# Altium schematic sheet PMT_simulator.SchDoc: =TopTitle
size 420 x 297 mm; EDA_Number: ARTIQ; Project: ALICE PMT; CheckedBy: -; Author: G.Kasprowicz; CompanyName: WUT ISE; DrawnBy: G.Kasprowicz; Organization: WUT ISE; Address1: PW ISE; Address2: Nowowiejska 15/19 00-665 Warsaw; Address3: gkasprow@gmail.com; SheetNumber: -; SheetTotal: -; ModifiedBy: -; CheckedDate: -; Title2: TOP; DivGrp: WUT ISE; Designer: G.Kasprowicz; ModifiedDate: -; ProjectName: Sensor Box
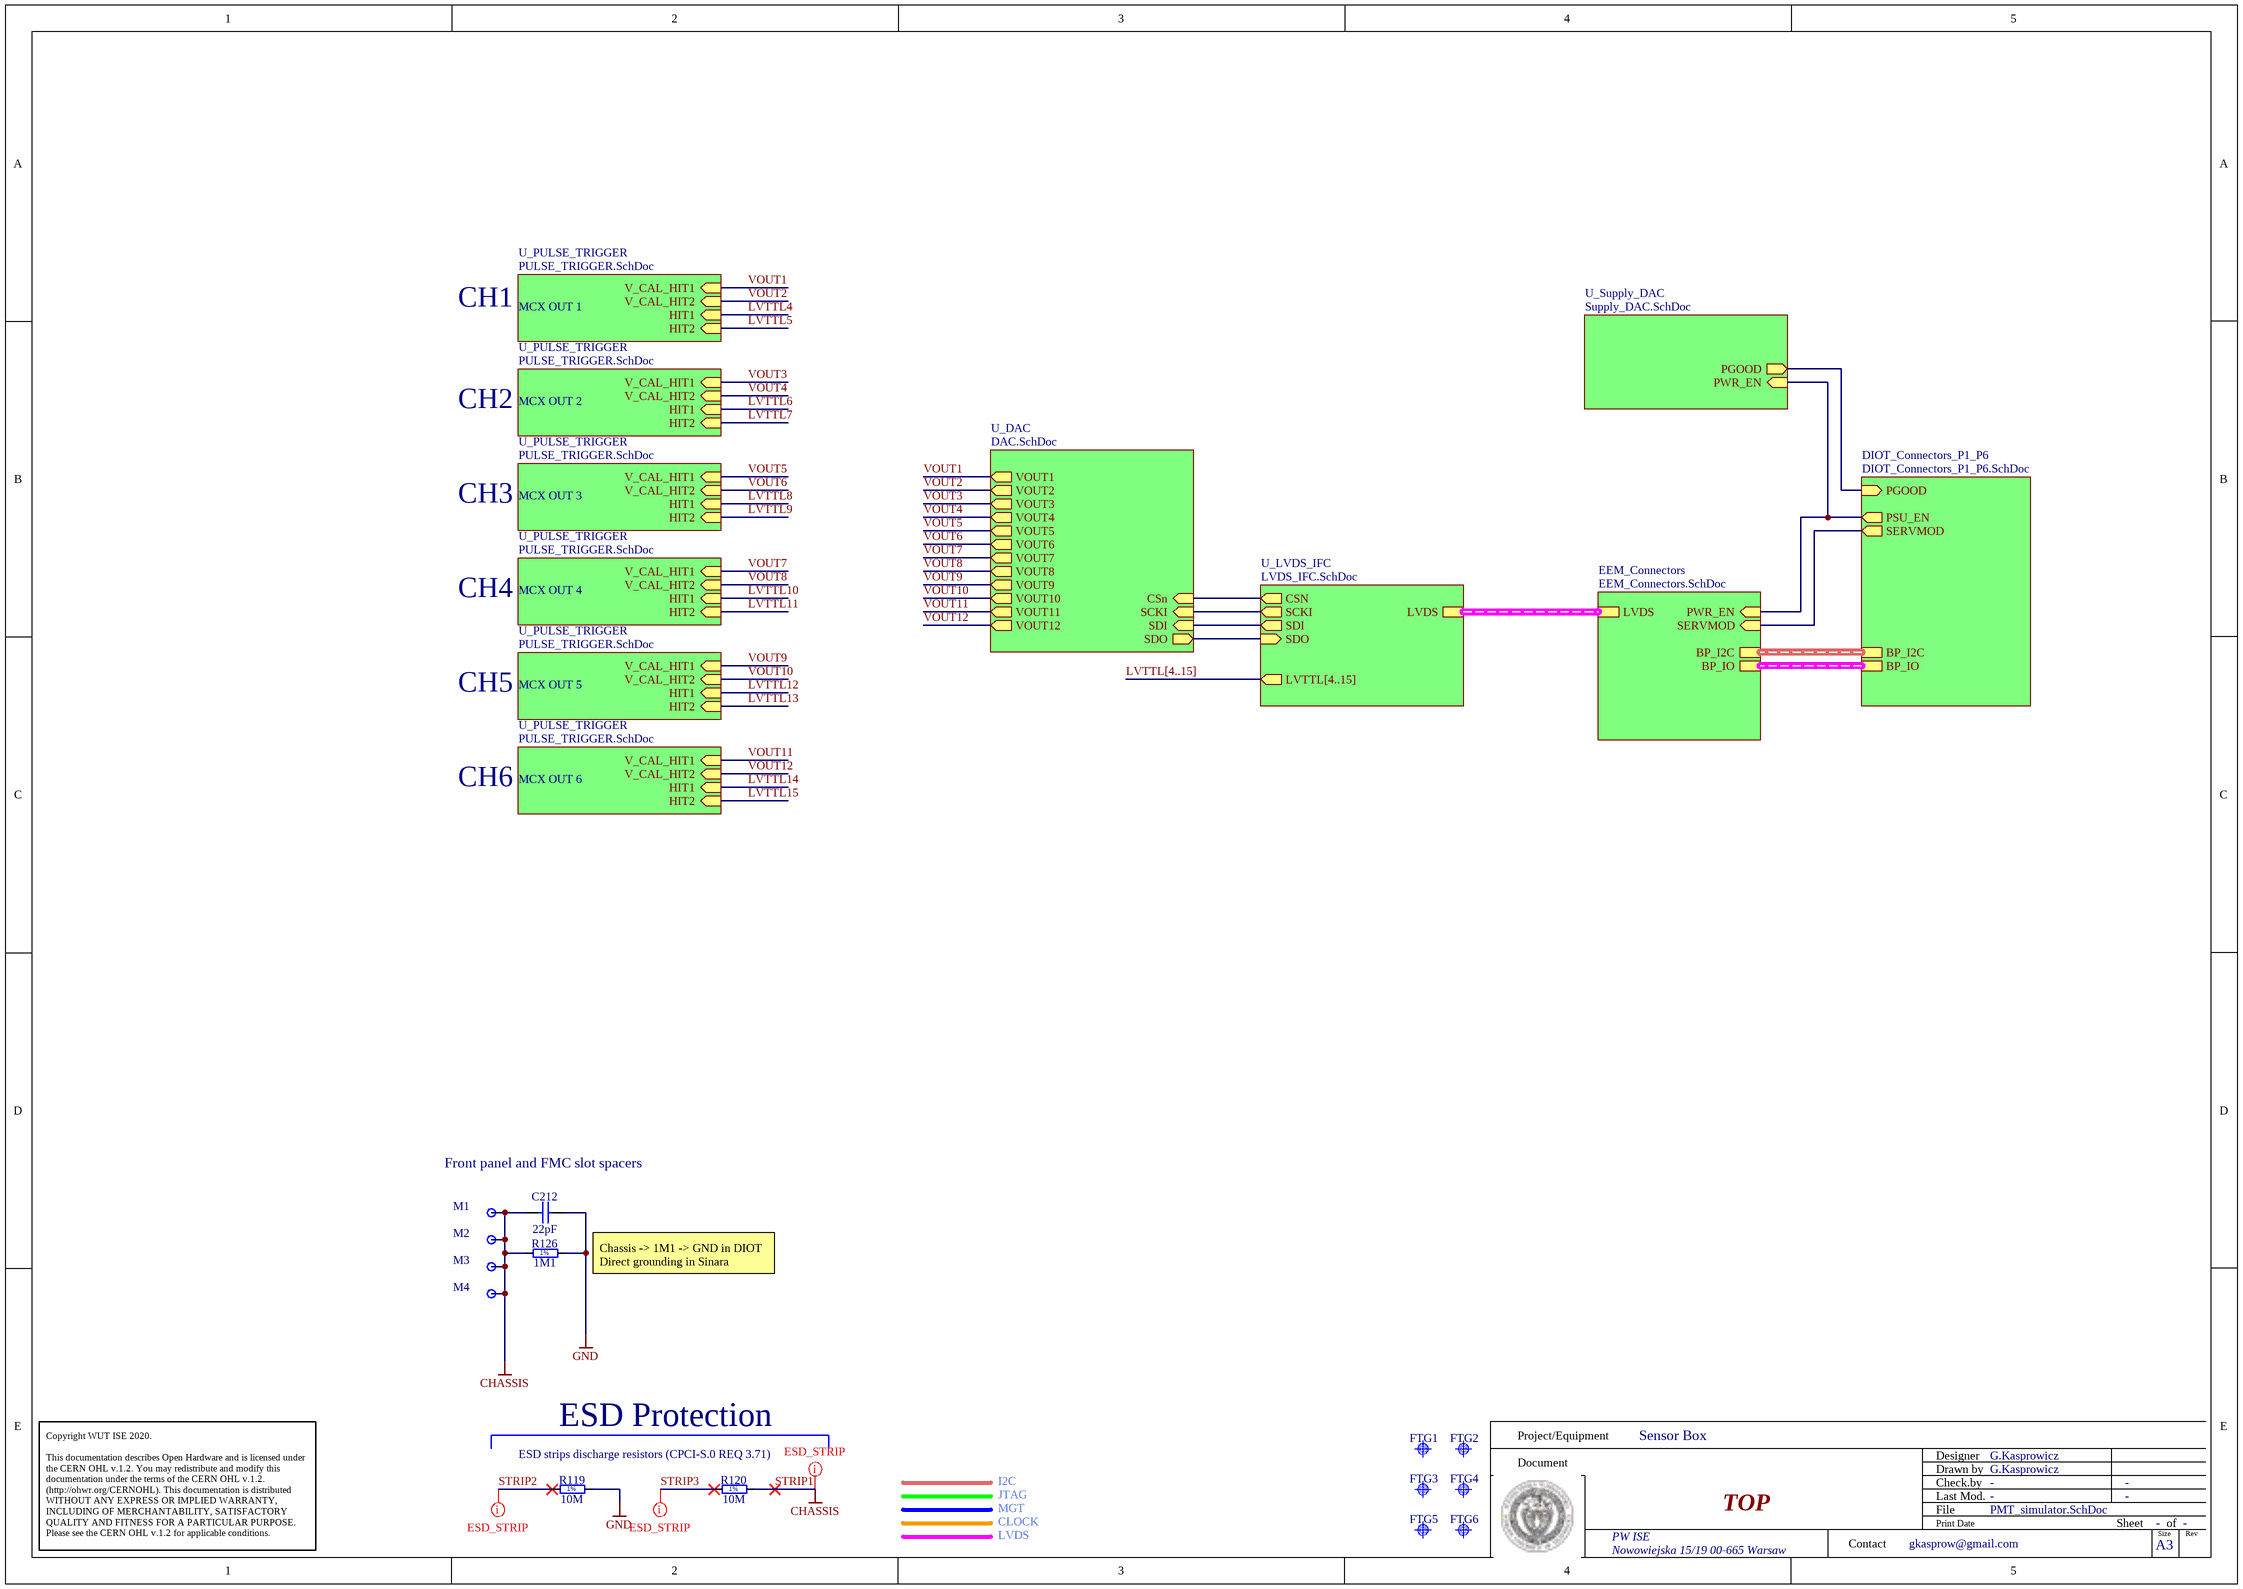
[diagram p0: PMT_simulator.SchDoc]

## Parts
C212  22pF  [CAPC1005X55N]
FTG1  Use only in PCB  [FIDUCIAL_TOP_S100-200]  (value not drawn)
FTG2  Use only in PCB  [FIDUCIAL_TOP_S100-200]  (value not drawn)
FTG3  Use only in PCB  [FIDUCIAL_TOP_S100-200]  (value not drawn)
FTG4  Use only in PCB  [FIDUCIAL_TOP_S100-200]  (value not drawn)
FTG5  Use only in PCB  [FIDUCIAL_TOP_S100-200]  (value not drawn)
FTG6  Use only in PCB  [FIDUCIAL_TOP_S100-200]  (value not drawn)
M1  Plated Hole  [MTG300_600]  (value not drawn)  (no BOM)
M2  Plated Hole  [MTG300_600]  (value not drawn)  (no BOM)
M3  Plated Hole  [MTG300_600]  (value not drawn)  (no BOM)
M4  Plated Hole  [MTG300_600]  (value not drawn)  (no BOM)
R119  10M  [RESC2113X55N]
R120  10M  [RESC2113X55N]
R126  1M1  [RESC2012X60N]

## Sub-sheets
DIOT_Connectors_P1_P6 = DIOT_Connectors_P1_P6.SchDoc: BP_I2C (harness I2C), BP_IO (harness EEM_LVDS), PSU_EN (out), SERVMOD (out), PGOOD (in)
EEM_Connectors = EEM_Connectors.SchDoc: LVDS (harness LVDS), BP_IO (harness EEM_LVDS), BP_I2C (harness I2C), SERVMOD (in), PWR_EN (in)
U_DAC = DAC.SchDoc: CSn (in), SDI (in), SCKI (in), SDO (out), VOUT1 (out), VOUT2 (out), VOUT3 (out), VOUT4 (out), VOUT5 (out), VOUT6 (out), VOUT7 (out), VOUT8 (out), VOUT9 (out), VOUT10 (out), VOUT11 (out), VOUT12 (out)
U_LVDS_IFC = LVDS_IFC.SchDoc: CSN (out), SDO (in), SCKI (out), SDI (out), LVDS (harness LVDS), LVTTL[4..15] (out)
U_PULSE_TRIGGER = PULSE_TRIGGER.SchDoc: V_CAL_HIT1 (in), V_CAL_HIT2 (in), HIT1 (in), HIT2 (in)
U_PULSE_TRIGGER = PULSE_TRIGGER.SchDoc: V_CAL_HIT1 (in), V_CAL_HIT2 (in), HIT1 (in), HIT2 (in)
U_PULSE_TRIGGER = PULSE_TRIGGER.SchDoc: V_CAL_HIT1 (in), V_CAL_HIT2 (in), HIT1 (in), HIT2 (in)
U_PULSE_TRIGGER = PULSE_TRIGGER.SchDoc: V_CAL_HIT1 (in), V_CAL_HIT2 (in), HIT1 (in), HIT2 (in)
U_PULSE_TRIGGER = PULSE_TRIGGER.SchDoc: V_CAL_HIT1 (in), V_CAL_HIT2 (in), HIT1 (in), HIT2 (in)
U_PULSE_TRIGGER = PULSE_TRIGGER.SchDoc: V_CAL_HIT1 (in), V_CAL_HIT2 (in), HIT1 (in), HIT2 (in)
U_Supply_DAC = Supply_DAC.SchDoc: PWR_EN (in), PGOOD (out)

## Nets
GND: C212.2 R119.2 R126.2
STRIP1: C212.1 M1.1 M2.1 M3.1 M4.1 R120.2 R126.1  [also labelled CHASSIS]
LVTTL4: sheet U_PULSE_TRIGGER/HIT1
LVTTL5: sheet U_PULSE_TRIGGER/HIT2
LVTTL6: sheet U_PULSE_TRIGGER/HIT1
LVTTL7: sheet U_PULSE_TRIGGER/HIT2
LVTTL8: sheet U_PULSE_TRIGGER/HIT1
LVTTL9: sheet U_PULSE_TRIGGER/HIT2
LVTTL10: sheet U_PULSE_TRIGGER/HIT1
LVTTL11: sheet U_PULSE_TRIGGER/HIT2
LVTTL12: sheet U_PULSE_TRIGGER/HIT1
LVTTL13: sheet U_PULSE_TRIGGER/HIT2
LVTTL14: sheet U_PULSE_TRIGGER/HIT1
LVTTL15: sheet U_PULSE_TRIGGER/HIT2
STRIP2: R119.1
STRIP3: R120.1
VOUT1: sheet U_PULSE_TRIGGER/V_CAL_HIT1, sheet U_DAC/VOUT1
VOUT2: sheet U_PULSE_TRIGGER/V_CAL_HIT2, sheet U_DAC/VOUT2
VOUT3: sheet U_DAC/VOUT3, sheet U_PULSE_TRIGGER/V_CAL_HIT1
VOUT4: sheet U_DAC/VOUT4, sheet U_PULSE_TRIGGER/V_CAL_HIT2
VOUT5: sheet U_DAC/VOUT5, sheet U_PULSE_TRIGGER/V_CAL_HIT1
VOUT6: sheet U_DAC/VOUT6, sheet U_PULSE_TRIGGER/V_CAL_HIT2
VOUT7: sheet U_DAC/VOUT7, sheet U_PULSE_TRIGGER/V_CAL_HIT1
VOUT8: sheet U_DAC/VOUT8, sheet U_PULSE_TRIGGER/V_CAL_HIT2
VOUT9: sheet U_DAC/VOUT9, sheet U_PULSE_TRIGGER/V_CAL_HIT1
VOUT10: sheet U_DAC/VOUT10, sheet U_PULSE_TRIGGER/V_CAL_HIT2
VOUT11: sheet U_DAC/VOUT11, sheet U_PULSE_TRIGGER/V_CAL_HIT1
VOUT12: sheet U_DAC/VOUT12, sheet U_PULSE_TRIGGER/V_CAL_HIT2
(unnamed): sheet DIOT_Connectors_P1_P6/PSU_EN, sheet EEM_Connectors/PWR_EN, sheet U_Supply_DAC/PWR_EN
(unnamed): sheet DIOT_Connectors_P1_P6/SERVMOD, sheet EEM_Connectors/SERVMOD
(unnamed): sheet DIOT_Connectors_P1_P6/PGOOD, sheet U_Supply_DAC/PGOOD
(unnamed): sheet U_LVDS_IFC/CSN, sheet U_DAC/CSn
(unnamed): sheet U_LVDS_IFC/SDO, sheet U_DAC/SDO
(unnamed): sheet U_LVDS_IFC/SCKI, sheet U_DAC/SCKI
(unnamed): sheet U_LVDS_IFC/SDI, sheet U_DAC/SDI

## Buses and harness runs
bus LVTTL[4..15] = sheet U_LVDS_IFC/LVTTL[4..15]
harness sheet DIOT_Connectors_P1_P6/BP_I2C = sheet EEM_Connectors/BP_I2C
harness sheet DIOT_Connectors_P1_P6/BP_IO = sheet EEM_Connectors/BP_IO
harness sheet EEM_Connectors/LVDS = sheet U_LVDS_IFC/LVDS

## Layout directives
net class ESD_STRIP: STRIP1, STRIP2, STRIP3

## Notes on the sheet
- CH1
- MCX OUT 1
- CH2
- MCX OUT 2
- CH3
- MCX OUT 3
- MCX OUT 4
- CH4
- CH5
- MCX OUT 5
- CH6
- MCX OUT 6
- Front panel and FMC slot spacers
- Chassis -> 1M1 -> GND in DIOT
  Direct grounding in Sinara
- ESD strips discharge resistors (CPCI-S.0 REQ 3.71)
- ESD Protection
- I2C
- JTAG
- MGT
- CLOCK
- LVDS
- Project/Equipment
- Document
- Designer
- Drawn by
- Check.by
- Copyright WUT ISE 2020.
  This documentation describes Open Hardware and is licensed under the CERN OHL v.1.2. You may redistribute and modify this documentation under the terms of the CERN OHL v.1.2. (http://ohwr.org/CERNOHL). This documentation is distributed WITHOUT ANY EXPRESS OR IMPLIED WARRANTY, INCLUDING OF MERCHANTABILITY, SATISFACTORY QUALITY AND FITNESS FOR A PARTICULAR PURPOSE. Please see the CERN OHL v.1.2 for applicable conditions.
- Contact
- File
- Last Mod.
- Print Date
- Sheet
- Size
- A3
- of
- Rev
- (in symbol R0805_1M1_1%_0.125W_100PPM) 1%
- (in symbol R0805_10M_1%_0.125W_100PPM_VISHAY_CRCW e3) 1%

## Library data of the parts
C212 = CC0402_22PF_50V_5%_C0G: Non-polarised capacitor; Part Description: SMD Multilayer Chip Ceramic Capacitor; Manufacturer: GENERIC; Manufacturer1 Part Number: C0402C220J5GACTU; Voltage: 50V; TC: C0G/NP0; Tolerance: ±5%; Part Number: CC0402_22PF_50V_5%_C0G; Component Kind: Standard; Component Type: Standard; Pin Count: 2; Value: 22pF; Status: Preferred; Manufacturer Part Number: CC0402_22PF_50V_5%_C0G; Case: 0402; Mounted: Yes; Socket: No; SMD: Yes; Manufacturer1 Example: KEMET; Manufacturer1 ComponentHeight: 0.55mm; HelpURL: \\cern.ch\dfs\Applications\Altium\Datasheets\CC0402_C0G_KEMET_(Commercial Grade).pdf; Author: CERN DEM JLC; CreateDate: 2007-12-03; LatestRevisionDate: 2007-12-03; Sense: No
FTG1-FTG6 = FIDUCIAL_TARGET_S100-200: Fiducial Target; Part Description: Square Fiducial Target, Top Layer, 1.0mm, Top Solder 2.0mm, Keepout =2.0mm; Mounted: No; Part Number: FIDUCIAL_TARGET_S100-200; Component Kind: Standard (No BOM); Component Type: Standard (No BOM); Pin Count: 1; Family: Fiducial; Socket: No; SMD: Yes; Sense: No; Status: None; ComponentHeight: 0mm; HelpURL: Undefined; Author: CERN DEM JLC; CreateDate: 09.02.2010; LatestRevisionDate: 04.04.2012; PackageDescription: Square Fiducial Target, Top Layer, 1.0mm, Top Solder 2.0mm, Keepout =2.0mm
M1-M4 = PLATED_HOLE3.0_PAD6.0: Single Terminal Socket; Part Description: Plated Through Hole: Hole Dia.=3.0mm Pad Dia.=6.0mm; Mounted: No; Table: Pads; Part Number: PLATED_HOLE3.0_PAD6.0; Component Type: Standard (No BOM); Designator: Single Terminal Socket; Library Reference: Single Terminal Socket; Pin Count: 1; Family: Plated Hole; Socket: No; SMD: No; Status: None; ComponentHeight: 0mm; Author: CERN DEM JLC; CreateDate: 26.05.2008; LatestRevisionDate: 26.05.2008; PackageDescription: Plated Through Hole: Hole Dia.=3.0mm Pad Dia.=6.0mm
R119 R120 = R0805_10M_1%_0.125W_100PPM_VISHAY_CRCW e3: Resistor - 1%; Part Description: 150V, Standard Thick Film Chip Resistor; Manufacturer: VISHAY DALE; Manufacturer Part Number: CRCW080510M0FKEA; Power: 0.125W; TC: ±100ppm/°C; PressFit: No; Part Number: R0805_10M_1%_0.125W_100PPM_VISHAY_CRCW e3; Component Kind: Standard; Component Type: Standard; Pin Count: 2; Value: 10M; Status: None; Tolerance: ±1%; Case: 0805; Mounted: Yes; Sense: No; Socket: No; SMD: Yes; ComponentHeight: 0.5mm; HelpURL: \\cern.ch\dfs\Applications\Altium\Datasheets\R0805_VISHAY_CRCW e3.pdf; Author: CERN DEM BC; CreateDate: 2019-11-12; LatestRevisionDate: 2019-11-12
R126 = R0805_1M1_1%_0.125W_100PPM: Resistor - 1%; Part Description: General Purpose Thick Film Chip Resistor; Manufacturer: GENERIC; Manufacturer1 Part Number: NRC10F1104TRF; Power: 0.125W; TC: ±100ppm/°C; PressFit: No; Part Number: R0805_1M1_1%_0.125W_100PPM; Component Kind: Standard; Component Type: Standard; Pin Count: 2; Value: 1M1; Status: Preferred; Tolerance: ±1%; Manufacturer Part Number: R0805_1M1_1%_0.125W_100PPM; Case: 0805; Mounted: Yes; Sense: No; Socket: No; SMD: Yes; Manufacturer1 Example: NIC COMPONENT; Manufacturer1 ComponentHeight: 0.6mm; HelpURL: \\cern.ch\dfs\Applications\Altium\Datasheets\R0805_NIC_NRC.pdf; Author: CERN DEM JLC; CreateDate: 03/12/2007; LatestRevisionDate: 13/03/2008